# EAGLE design Schematics-1 (EAGLE 7.5.0)
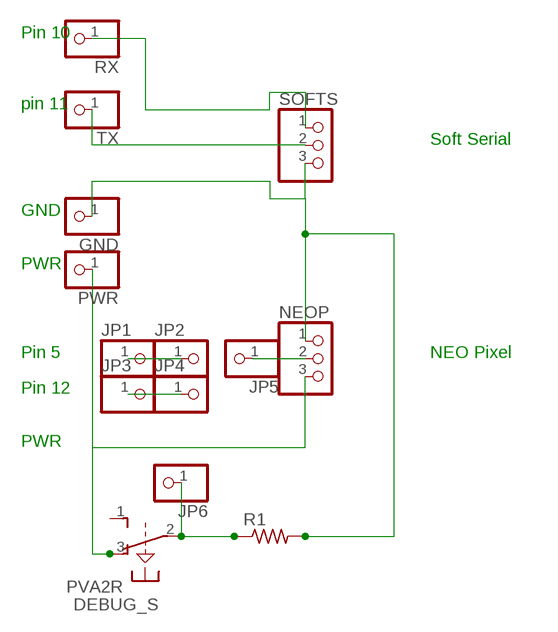
[diagram p0: schematic, sheet 1]

## Parts
DEBUG_S  PVA2R  [PVA2R]
GND  PINHD-1X1CB  [1X01-CLEANBIG]
JP1  PINHD-1X1CB  [1X01-CLEANBIG]
JP2  PINHD-1X1CB  [1X01-CLEANBIG]
JP3  PINHD-1X1CB  [1X01-CLEANBIG]
JP4  PINHD-1X1CB  [1X01-CLEANBIG]
JP5  PINHD-1X1CB  [1X01-CLEANBIG]
JP6  PINHD-1X1CB  [1X01-CLEANBIG]
NEOP  PINHD-1X3CB  [1X03-CLEANBIG]
PWR  PINHD-1X1CB  [1X01-CLEANBIG]
R1  R-US_0204/7  [0204/7]
RX  PINHD-1X1CB  [1X01-CLEANBIG]
SOFTS  PINHD-1X3CB  [1X03-CLEANBIG]
TX  PINHD-1X1CB  [1X01-CLEANBIG]

## Nets
N$1: RX.1 SOFTS.1
N$2: JP1.1 JP2.1
N$3: SOFTS.2 TX.1
N$4: GND.1 NEOP.1 R1.2 SOFTS.3
N$5: DEBUG_S.3(1:O) NEOP.3 PWR.1
N$6: DEBUG_S.2(1:P) JP6.1 R1.1
N$7: JP5.1 NEOP.2
N$8: JP3.1 JP4.1
Unconnected: DEBUG_S.1(1:S) DEBUG_S.4(2:S) DEBUG_S.5(2:P) DEBUG_S.6(2:O)

## Notes on the sheet
- Pin 10
- pin 11
- Soft Serial
- GND
- PWR
- Pin 5 | NEO Pixel
- Pin 12
- PWR

## Library data of the parts
DEBUG_S = switch-misc:PVA2R: ITT SWITCH
GND JP1-JP6 PWR RX TX = adafruit:PINHD-1X1: Pin header 1x1 for 0.1" spacing With round pins
NEOP SOFTS = adafruit:PINHD-1X3: PIN HEADER
R1 = adafruit:R-US_: RESISTOR, American symbol

## Board
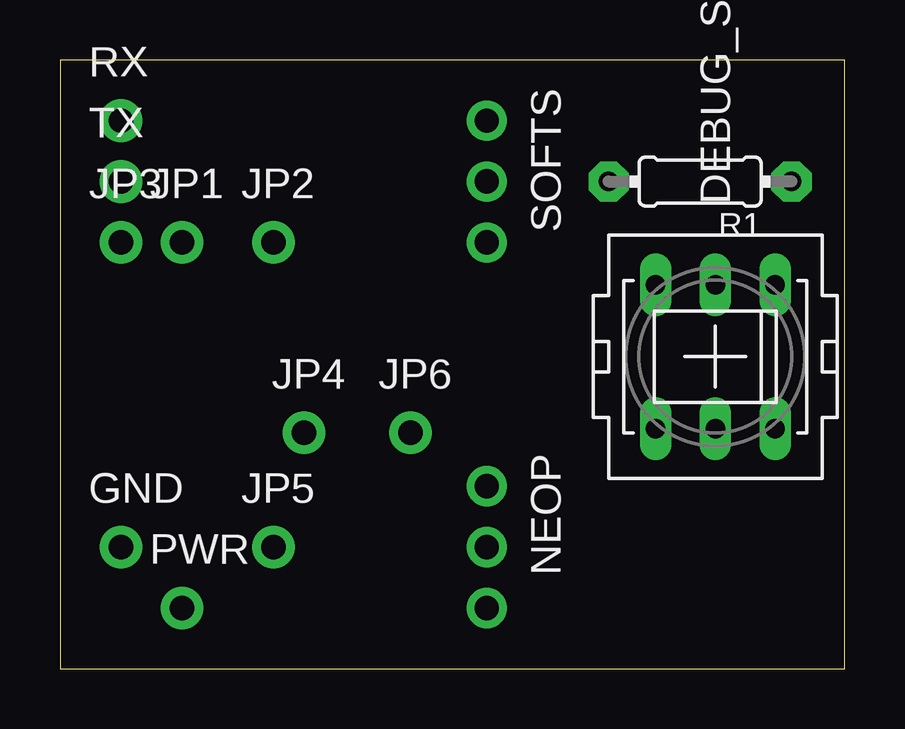
[diagram p1: board, top side]
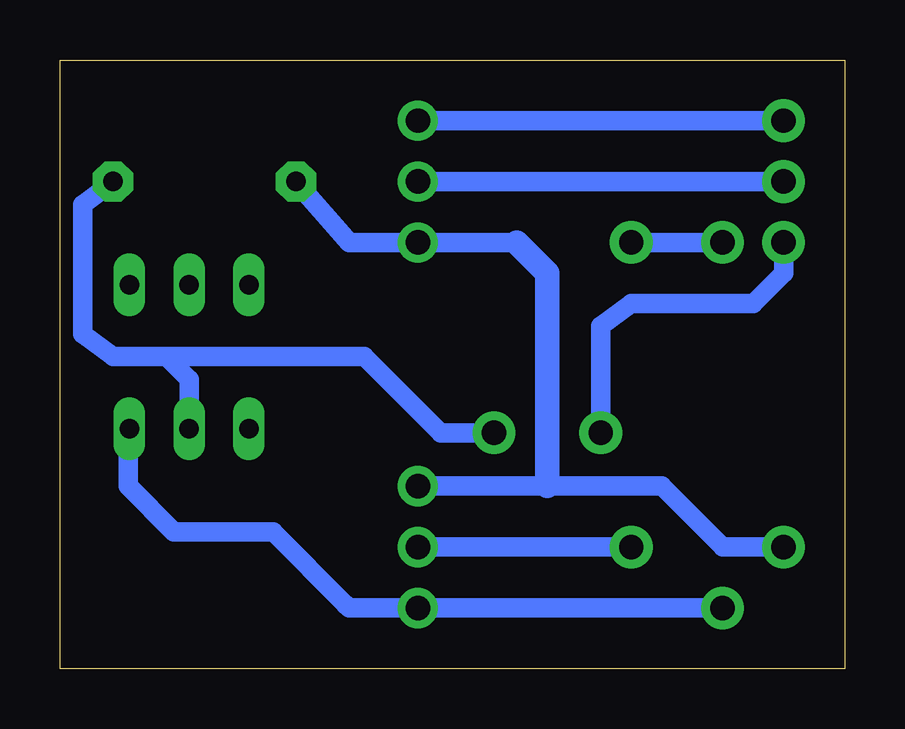
[diagram p2: board, bottom side, seen from below]

Size 32.69 x 25.39 mm. Coordinates in mm from the lower left corner, seen from the top.
Outline: 0,0 32.69,0 32.69,25.39 0,25.39 0,0
Copper layers (1*16): Top 0.035mm / dielectric 1.5mm / Bottom 0.035mm
Design rules "default": minimum track width 10mil, minimum drill 24mil, track to track 8mil, track to pad 8mil, pad to pad 8mil, via to via 8mil, smd to smd 8mil, copper to edge 40mil, drill to drill 8mil, minimum pad ring 10mil, minimum via ring 8mil, stop-mask expansion 4mil, vias tented up to drill 0mil, thermal gap 10mil

### Footprints (pad centres in the part's own frame; a part is rotated, then mirrored left to right if it is on the bottom)
PVA2R = drill 0.813 long: 1 -2.997,2.489; 2 -2.997,0; 3 -2.997,-2.489; 4 2.997,2.489; 5 2.997,0; 6 2.997,-2.489
1X01-CLEANBIG = drill 1.016 pad 1.778: 1 0,0
1X03-CLEANBIG = drill 1.016 pad 1.676: 1 -2.54,0; 2 0,0; 3 2.54,0
0204/7 = drill 0.813 pad 1.676 octagon: 1 -3.81,0; 2 3.81,0

### Placement (x,y rotation side)
DEBUG_S  27.3,13.02 90 top
GND  2.54,5.08 0 top
JP1  5.08,17.78 0 top
JP2  8.89,17.78 0 top
JP3  2.54,17.78 0 top
JP4  10.16,9.84 0 top
JP5  8.89,5.08 0 top
JP6  14.61,9.84 0 top
NEOP  17.78,5.08 270 top
PWR  5.08,2.54 0 top
R1  26.67,20.32 180 top
RX  2.54,22.86 0 top
SOFTS  17.78,20.32 270 top
TX  2.54,20.32 0 top

### Tracks (layer width: path | path; a pad name or v marks a point on that pad's centre or on a via)
N$1
  Bottom 0.813: RX.1 SOFTS.1
N$2
  Bottom 0.813: JP1.1 JP2.1
N$3
  Bottom 0.813: TX.1 SOFTS.2
N$4
  Bottom 0.813: GND.1 5.08,5.08 7.62,7.62 12.38,7.62 NEOP.1 | R1.2 20.64,17.78 18.1,17.78 SOFTS.3 13.65,17.78
  Bottom 1.016: 12.38,7.62 12.38,16.51 13.65,17.78
N$5
  Bottom 0.813: DEBUG_S.3 29.84,9.97 29.84,7.62 27.94,5.71 23.81,5.71 20.8,2.7 20.64,2.54 NEOP.3 PWR.1
N$6
  Bottom 0.813: DEBUG_S.2 27.3,12.06 28.26,13.02 | 28.26,13.02 30.48,13.02 31.75,13.97 31.75,19.37 R1.1 | JP6.1 16.83,9.84 20,13.02 28.26,13.02
N$7
  Bottom 0.813: JP5.1 NEOP.2
N$8
  Bottom 0.813: JP3.1 2.54,16.51 3.81,15.24 8.89,15.24 10.16,14.29 JP4.1